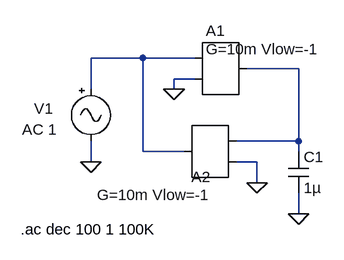
[diagram p0: schematic EJ5_OTA_CtoL.asc]
EJ5_OTA_CtoL.asc, the LTspice schematic file:
Version 4
SHEET 1 880 680
WIRE 80 80 0 80
WIRE 160 80 80 80
WIRE 320 96 240 96
WIRE 160 112 128 112
WIRE 0 128 0 80
WIRE 128 128 128 112
WIRE 320 208 320 96
WIRE 320 208 224 208
WIRE 80 224 80 80
WIRE 144 224 80 224
WIRE 320 224 320 208
WIRE 0 240 0 208
WIRE 256 240 224 240
WIRE 256 272 256 240
WIRE 320 320 320 288
FLAG 320 320 0
FLAG 0 240 0
FLAG 256 272 0
FLAG 128 128 0
SYMBOL SpecialFunctions\\ota 192 160 M180
WINDOW 0 -15 122 Left 2
WINDOW 3 -15 94 Left 2
SYMATTR InstName A1
SYMATTR Value G=10m Vlow=-1
SYMBOL SpecialFunctions\\ota 192 160 M0
WINDOW 0 8 103 Left 2
WINDOW 3 8 131 Left 2
SYMATTR InstName A2
SYMATTR Value G=10m Vlow=-1
SYMBOL cap 304 224 R0
SYMATTR InstName C1
SYMATTR Value 1µ
SYMBOL Misc\\signal 0 112 R0
WINDOW 0 -87 46 Left 2
WINDOW 3 -194 82 Left 2
WINDOW 123 -106 78 Left 2
WINDOW 39 0 0 Left 0
SYMATTR InstName V1
SYMATTR Value ""
SYMATTR Value2 AC 1
TEXT -108 344 Left 2 !.ac dec 100 1 100K

The netlist it stands for:
* EJ5_OTA_CtoL.asc
A1 0 N001 0 0 0 0 N002 0 OTA G=10m Vlow=-1
A2 N002 0 0 0 0 0 N001 0 OTA G=10m Vlow=-1
C1 N002 0 1µ
V1 N001 0 AC 1
.ac dec 100 1 100K
.backanno
.end